# Altium project PCB_Project.PrjPcb
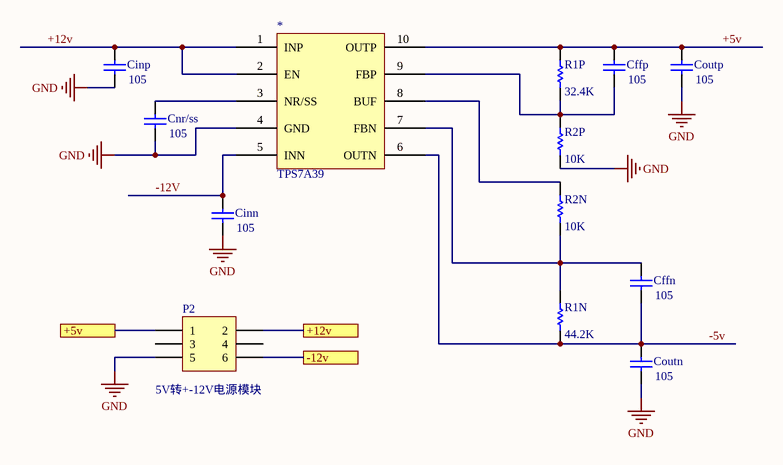
[diagram p0: 电源模块.schdoc]
3 sheets, 278 parts. Net scope: flat (ports and power ports of the same name join across sheets).
Board file: AT long bus (13.3 x 4.2 inches).PCBDOC
Sheets:
  电源模块.schdoc
  总电路图.SchDoc
  总电路图2.SchDoc

## Sheet 电源模块.schdoc: AT long bus (13.3 x 4.2 inches)
size A4; Organization: Organization; Address1: Address1; Address2: Address2; Address3: Address3; Address4: Address4; DocumentNumber: 1; Revision: 0; SheetNumber: 2; SheetTotal: 2

### Parts
*  TPS7A39
Cffn  value 105  [RAD-0.3]  (hidden comment: Cap)
Cffp  value 105  [RAD-0.3]  (hidden comment: Cap)
Cinn  value 105  [RAD-0.3]  (hidden comment: Cap)
Cinp  value 105  [RAD-0.3]  (hidden comment: Cap)
Cnr/ss  value 105  [RAD-0.3]  (hidden comment: Cap)
Coutn  value 105  [RAD-0.3]  (hidden comment: Cap)
Coutp  value 105  [RAD-0.3]  (hidden comment: Cap)
P2  5V转+-12V电源模块  [HDR2X3]
R1N  value 44.2K  [AXIAL-0.3]  (hidden comment: Res1)
R1P  value 32.4K  [AXIAL-0.3]  (hidden comment: Res1)
R2N  value 10K  [AXIAL-0.3]  (hidden comment: Res1)
R2P  value 10K  [AXIAL-0.3]  (hidden comment: Res1)

### Ports
+5v, +12v, -12v

### Nets
GND: *.4(GND) Cinn.1 Cinp.1 Cnr/ss.1 Coutn.1 Coutp.1 P2.5 R2P.1
+5v: *.10(OUTP) Cffp.2 Coutp.2 R1P.2
+12v: *.1(INP) *.2(EN) Cinp.2
-5v: *.6(OUTN) Cffn.1 Coutn.2 R1N.1
-12V: *.5(INN) Cinn.2
Net*_3: *.3(NR/SS) Cnr/ss.2
Net*_7: *.7(FBN) Cffn.2 R1N.2 R2N.1
Net*_8: *.8(BUF) R2N.2
Net*_9: *.9(FBP) Cffp.1 R1P.1 R2P.2
NetP2_1: P2.1 ; port +5v
NetP2_2: P2.2 ; port +12v
NetP2_6: P2.6 ; port -12v

Not connected (* = marked no-connect by the designer): P2 3 4

### Library data of the parts
Cffn Cffp Cinn Cinp Cnr/ss Coutn Coutp = Cap: Capacitor; Published: 8-Jun-2000; LatestRevisionDate: 17-Jul-2002; LatestRevisionNote: Re-released for DXP Platform.; PackageReference: RAD-0.3; Publisher: Altium Limited; PackageDescription: Radial Cap, Thru-Hole; 2 Leads; 0.3 in Pin Spacing
P2 = Header 3X2: Header, 3-Pin, Dual row; LatestRevisionDate: 17-Jul-2002; LatestRevisionNote: Re-released for DXP Platform.; Publisher: Altium Limited
R1N R1P R2N R2P = Res1: Resistor; Published: 8-Jun-2000; LatestRevisionDate: 17-Jul-2002; LatestRevisionNote: Re-released for DXP Platform.; PackageReference: AXIAL-0.3; Publisher: Altium Limited; PackageDescription: Axial Device, Thru-Hole; 2 Leads; 0.3 in Pin Spacing

## Sheet 总电路图.SchDoc
size A2; Organization: Altium Limited; Address1: L3, 12a Rodborough Rd; Address2: Frenchs Forest; Address3: NSW; Address4: Australia 2086
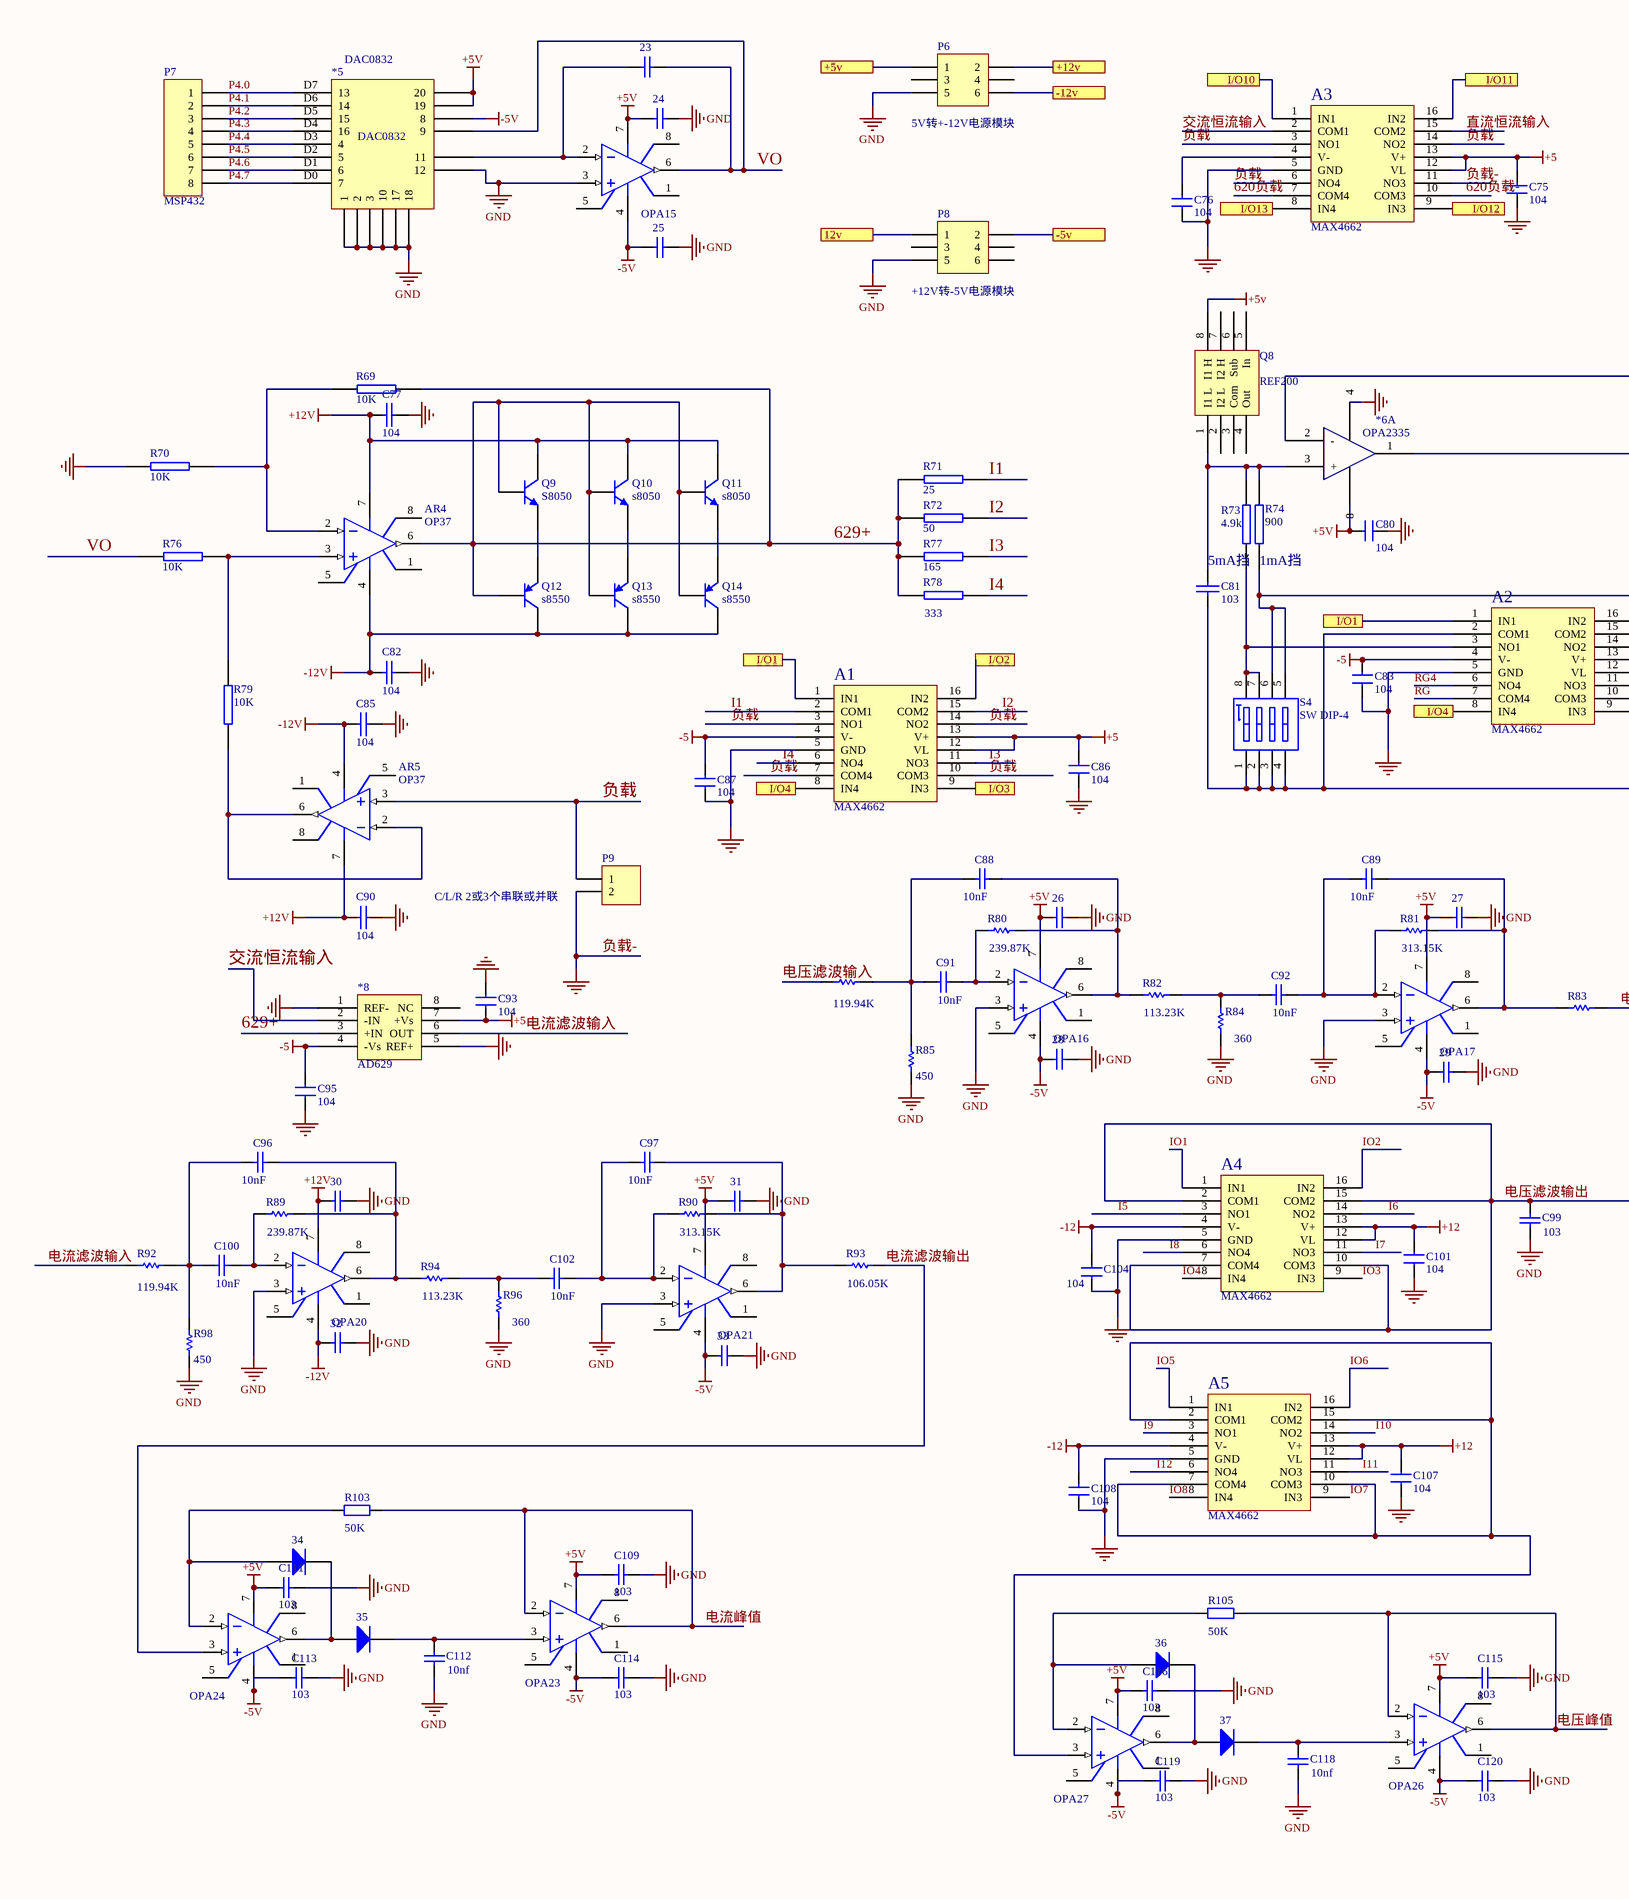
[diagram p1: 总电路图.SchDoc, left]
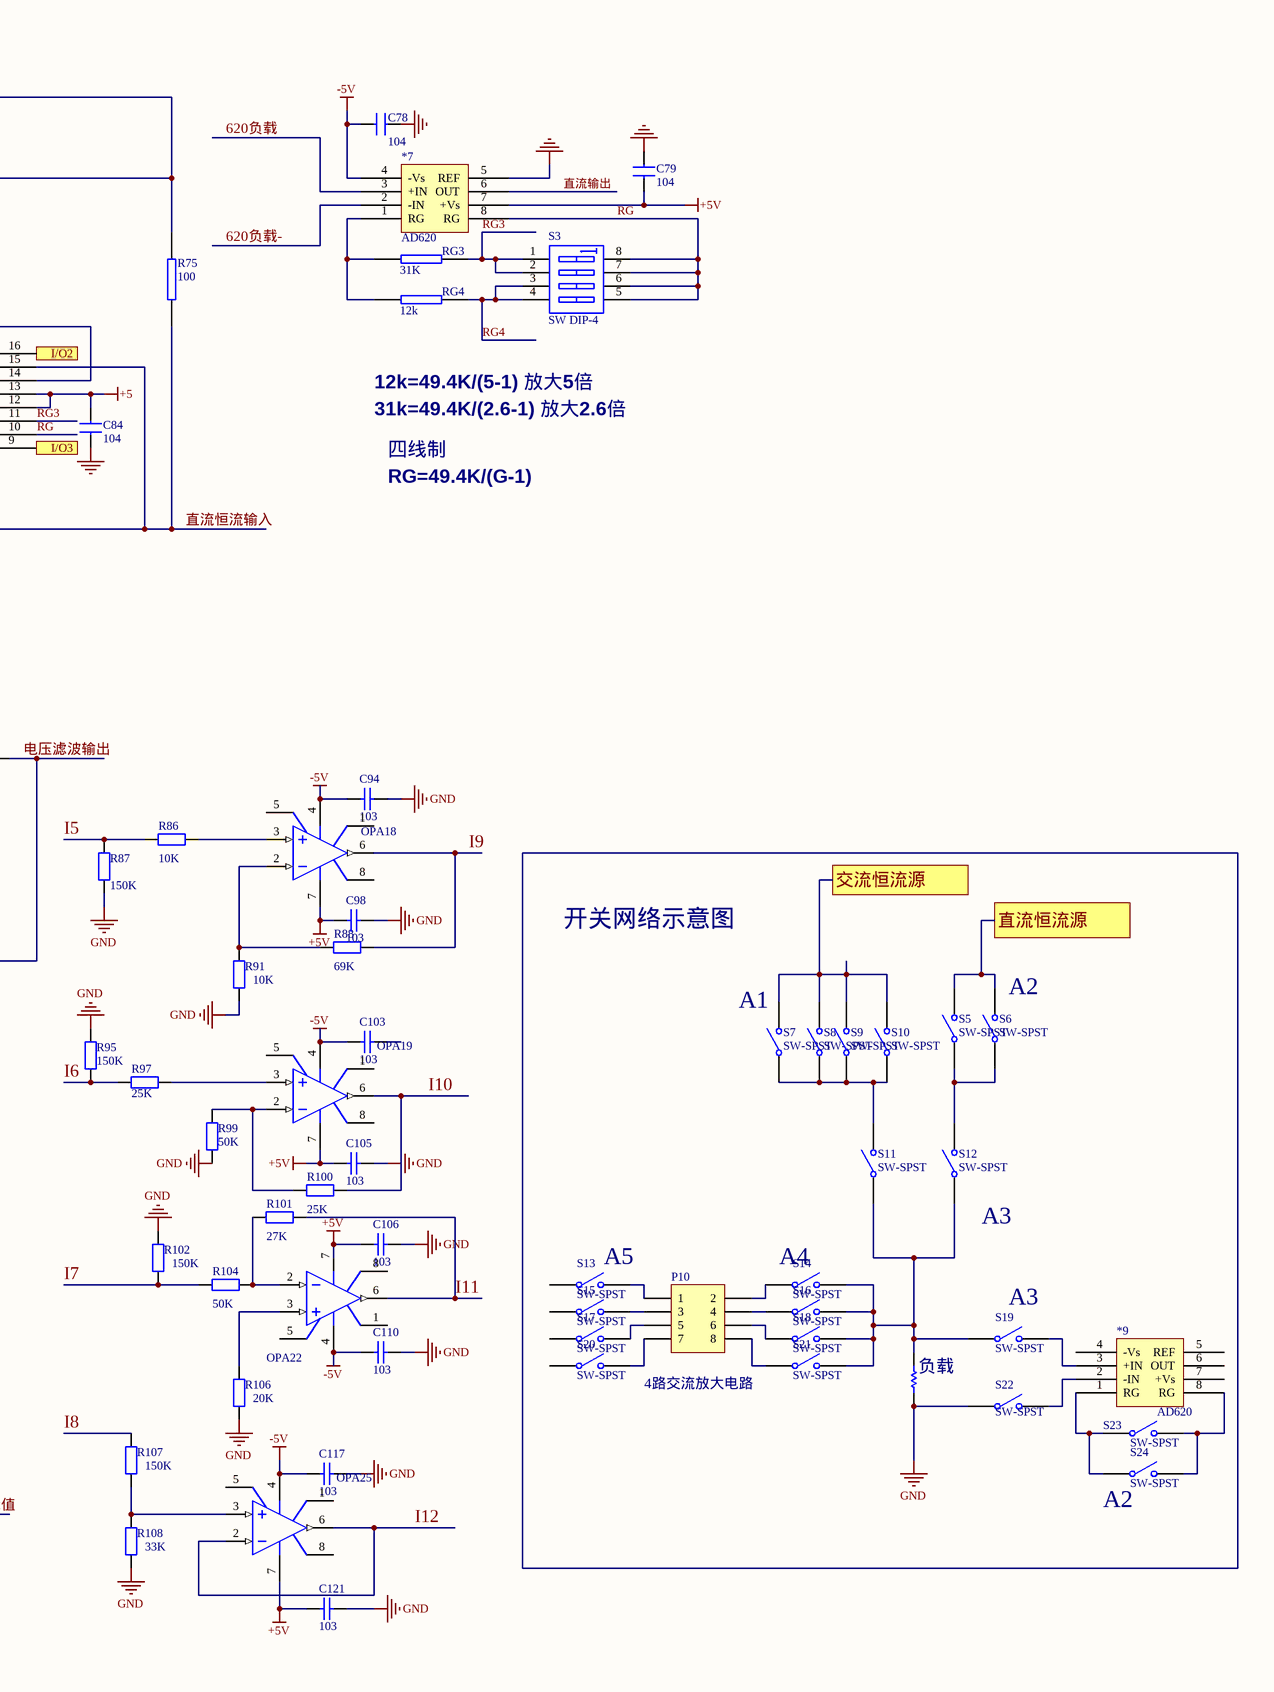
[diagram p2: 总电路图.SchDoc, right]

### Parts
23  Cap  [RAD-0.3]  (value not drawn)
24  Cap  [RAD-0.3]  (value not drawn)
25  Cap  [RAD-0.3]  (value not drawn)
26  Cap  [RAD-0.3]  (value not drawn)
27  Cap  [RAD-0.3]  (value not drawn)
28  Cap  [RAD-0.3]  (value not drawn)
29  Cap  [RAD-0.3]  (value not drawn)
30  Cap  [RAD-0.3]  (value not drawn)
31  Cap  [RAD-0.3]  (value not drawn)
32  Cap  [RAD-0.3]  (value not drawn)
33  Cap  [RAD-0.3]  (value not drawn)
34  Diode 1N4001  [DO-41]  (value not drawn)
35  Diode 1N4001  [DO-41]  (value not drawn)
36  Diode 1N4001  [DO-41]  (value not drawn)
37  Diode 1N4001  [DO-41]  (value not drawn)
*5  DAC0832
*6  OPA2335  (part A of 2)
*7  AD620
*8  AD629
*9  AD620
?  value 119.94K  [AXIAL-0.3]  (hidden comment: Res1)
A1  MAX4662
A2  MAX4662
A3  MAX4662
A4  MAX4662
A5  MAX4662
AR4  OP37  [H-08A]
AR5  OP37  [H-08A]
C75  104  [RAD0.1]
C76  104  [RAD0.1]
C77  104
C78  104  [RAD0.1]
C79  104  [RAD0.1]
C80  104  [RAD0.1]
C81  103
C82  104
C83  104  [RAD0.1]
C84  104  [RAD0.1]
C85  104
C86  104  [RAD0.1]
C87  104  [RAD0.1]
C88  value 10nF  [RAD-0.3]  (hidden comment: Cap)
C89  value 10nF  [RAD-0.3]  (hidden comment: Cap)
C90  104
C91  value 10nF  [RAD-0.3]  (hidden comment: Cap)
C92  value 10nF  [RAD-0.3]  (hidden comment: Cap)
C93  104  [RAD0.1]
C94  value 103  [RAD-0.3]  (hidden comment: Cap)
C95  104  [RAD0.1]
C96  value 10nF  [RAD-0.3]  (hidden comment: Cap)
C97  value 10nF  [RAD-0.3]  (hidden comment: Cap)
C98  value 103  [RAD-0.3]  (hidden comment: Cap)
C99  value 103  [RAD-0.3]  (hidden comment: Cap)
C100  value 10nF  [RAD-0.3]  (hidden comment: Cap)
C101  104  [RAD0.1]
C102  value 10nF  [RAD-0.3]  (hidden comment: Cap)
C103  value 103  [RAD-0.3]  (hidden comment: Cap)
C104  104  [RAD0.1]
C105  value 103  [RAD-0.3]  (hidden comment: Cap)
C106  value 103  [RAD-0.3]  (hidden comment: Cap)
C107  104  [RAD0.1]
C108  104  [RAD0.1]
C109  value 103  [RAD-0.3]  (hidden comment: Cap)
C110  value 103  [RAD-0.3]  (hidden comment: Cap)
C111  value 103  [RAD-0.3]  (hidden comment: Cap)
C112  value 10nf  [RAD-0.3]  (hidden comment: Cap)
C113  value 103  [RAD-0.3]  (hidden comment: Cap)
C114  value 103  [RAD-0.3]  (hidden comment: Cap)
C115  value 103  [RAD-0.3]  (hidden comment: Cap)
C116  value 103  [RAD-0.3]  (hidden comment: Cap)
C117  value 103  [RAD-0.3]  (hidden comment: Cap)
C118  value 10nf  [RAD-0.3]  (hidden comment: Cap)
C119  value 103  [RAD-0.3]  (hidden comment: Cap)
C120  value 103  [RAD-0.3]  (hidden comment: Cap)
C121  value 103  [RAD-0.3]  (hidden comment: Cap)
OPA15  Op Amp  [H-08A]  (value not drawn)
OPA16  Op Amp  [H-08A]  (value not drawn)
OPA17  Op Amp  [H-08A]  (value not drawn)
OPA18  Op Amp  [H-08A]  (value not drawn)
OPA19  Op Amp  [H-08A]  (value not drawn)
OPA20  Op Amp  [H-08A]  (value not drawn)
OPA21  Op Amp  [H-08A]  (value not drawn)
OPA22  Op Amp  [H-08A]  (value not drawn)
OPA23  Op Amp  [H-08A]  (value not drawn)
OPA24  Op Amp  [H-08A]  (value not drawn)
OPA25  Op Amp  [H-08A]  (value not drawn)
OPA26  Op Amp  [H-08A]  (value not drawn)
OPA27  Op Amp  [H-08A]  (value not drawn)
P6  5V转+-12V电源模块  [HDR2X3]
P7  MSP432  [HDR1X8]
P8  +12V转-5V电源模块  [HDR2X3]
P9  C/L/R 2或3个串联或并联  [HDR1X2H]
P10  4路交流放大电路  [HDR2X4]
Q8  REF200
Q9  S8050  [TO-92A]
Q10  s8050  [TO-92A]
Q11  s8050  [TO-92A]
Q12  s8550  [TO-92A]
Q13  s8550  [TO-92A]
Q14  s8550  [TO-92A]
R69  10K
R70  10K
R71  25
R72  50
R73  4.9k
R74  900
R75  100
R76  10K
R77  165
R78  333  [AXIAL0.3]
R79  10K
R80  value 239.87K  [AXIAL-0.3]  (hidden comment: Res1)
R81  value 313.15K  [AXIAL-0.3]  (hidden comment: Res1)
R82  value 113.23K  [AXIAL-0.3]  (hidden comment: Res1)
R83  Res1  [AXIAL-0.3]  (value not drawn)
R84  value 360  [AXIAL-0.3]  (hidden comment: Res1)
R85  value 450  [AXIAL-0.3]  (hidden comment: Res1)
R86  value 10K  [AXIAL-0.4]  (hidden comment: Res2)
R87  value 150K  [AXIAL-0.4]  (hidden comment: Res2)
R88  value 69K  [AXIAL-0.4]  (hidden comment: Res2)
R89  value 239.87K  [AXIAL-0.3]  (hidden comment: Res1)
R90  value 313.15K  [AXIAL-0.3]  (hidden comment: Res1)
R91  value 10K  [AXIAL-0.4]  (hidden comment: Res2)
R92  value 119.94K  [AXIAL-0.3]  (hidden comment: Res1)
R93  value 106.05K  [AXIAL-0.3]  (hidden comment: Res1)
R94  value 113.23K  [AXIAL-0.3]  (hidden comment: Res1)
R95  value 150K  [AXIAL-0.4]  (hidden comment: Res2)
R96  value 360  [AXIAL-0.3]  (hidden comment: Res1)
R97  value 25K  [AXIAL-0.4]  (hidden comment: Res2)
R98  value 450  [AXIAL-0.3]  (hidden comment: Res1)
R99  value 50K  [AXIAL-0.4]  (hidden comment: Res2)
R100  value 25K  [AXIAL-0.4]  (hidden comment: Res2)
R101  value 27K  [AXIAL-0.4]  (hidden comment: Res2)
R102  value 150K  [AXIAL-0.4]  (hidden comment: Res2)
R103  value 50K  [AXIAL-0.4]  (hidden comment: Res2)
R104  value 50K  [AXIAL-0.4]  (hidden comment: Res2)
R105  value 50K  [AXIAL-0.4]  (hidden comment: Res2)
R106  value 20K  [AXIAL-0.4]  (hidden comment: Res2)
R107  value 150K  [AXIAL-0.4]  (hidden comment: Res2)
R108  value 33K  [AXIAL-0.4]  (hidden comment: Res2)
RG3  31K  [AXIAL0.3]
RG4  12k  [AXIAL0.3]
S3  SW DIP-4  [SO8_N]
S4  SW DIP-4  [SO8_N]
S5  SW-SPST  [SPST-2]
S6  SW-SPST  [SPST-2]
S7  SW-SPST  [SPST-2]
S8  SW-SPST  [SPST-2]
S9  SW-SPST  [SPST-2]
S10  SW-SPST  [SPST-2]
S11  SW-SPST  [SPST-2]
S12  SW-SPST  [SPST-2]
S13  SW-SPST  [SPST-2]
S14  SW-SPST  [SPST-2]
S15  SW-SPST  [SPST-2]
S16  SW-SPST  [SPST-2]
S17  SW-SPST  [SPST-2]
S18  SW-SPST  [SPST-2]
S19  SW-SPST  [SPST-2]
S20  SW-SPST  [SPST-2]
S21  SW-SPST  [SPST-2]
S22  SW-SPST  [SPST-2]
S23  SW-SPST  [SPST-2]
S24  SW-SPST  [SPST-2]
负载  Res1  [AXIAL-0.3]  (value not drawn)

### Ports
12v, +5v, +12v, -5v, -12v, I/O1, I/O2, I/O3, I/O4, I/O10, I/O11, I/O12, I/O13, 交流恒流源, 直流恒流源

### Nets
+5: *8.7(+Vs) A1.12(VL) A1.13(V+) A2.12(VL) A2.13(V+) A3.12(VL) A3.13(V+) C75.1 C84.1 C86.1 C93.1
+5V: 24.1 26.1 27.1 31.1 *5.D14(20) *5.D15(19) *7.7(+Vs) C79.1 C80.1 C98.2 C105.2 C106.2 C109.2 C111.2 C115.2 C116.2 C121.2 OPA15.7(V+) OPA16.7(V+) OPA17.7(V+) OPA18.7(V+) OPA19.7(V+) OPA21.7(V+) OPA22.7(V+) OPA23.7(V+) OPA24.7(V+) OPA25.7(V+) OPA26.7(V+) OPA27.7(V+) Q8.8(I1_H)
+12: A4.12(VL) A4.13(V+) A5.12(VL) A5.13(V+) C101.1 C107.1
+12V: 30.1 AR4.7(V+) AR5.7(V+) C77.1 C90.1 OPA20.7(V+) Q9.3(C) Q10.3(C) Q11.3(C)
-5: *8.4(-Vs) A1.4(V-) A2.4(V-) C83.2 C87.2 C95.1
-5V: 25.1 28.1 29.1 33.1 *5.D16(8) *7.4(-Vs) C78.1 C94.2 C103.2 C110.2 C113.2 C114.2 C117.2 C119.2 C120.2 OPA15.4(V-) OPA16.4(V-) OPA17.4(V-) OPA18.4(V-) OPA19.4(V-) OPA21.4(V-) OPA22.4(V-) OPA23.4(V-) OPA24.4(V-) OPA25.4(V-) OPA26.4(V-) OPA27.4(V-)
-12: A4.4(V-) A5.4(V-) C104.2 C108.2
-12V: 32.1 AR4.4(V-) AR5.4(V-) C82.1 C85.1 OPA20.4(V-) Q12.3(C) Q13.3(C) Q14.3(C)
GND: 24.2 25.2 26.2 27.2 28.2 29.2 30.2 31.2 32.2 33.2 *5.D8(1) *5.D9(2) *5.D10(3) *5.D11(10) *5.D12(17) *5.D13(18) *5.D19(12) A1.5(GND) A2.5(GND) A3.5(GND) A4.5(GND) A5.5(GND) C75.2 C76.1 C77.2 C78.2 C79.2 C80.2 C82.2 C83.1 C84.2 C85.2 C86.2 C87.1 C90.2 C93.2 C94.1 C95.2 C98.1 C99.1 C101.2 C104.1 C105.1 C106.1 C107.2 C108.1 C109.1 C110.1 C111.1 C112.2 C113.1 C114.1 C115.1 C116.1 C117.1 C118.2 C119.1 C120.1 C121.1 OPA15.3(IN+) OPA16.3(IN+) OPA17.3(IN+) OPA20.3(IN+) OPA21.3(IN+) P6.5 P8.5 R70.2 R84.1 R85.1 R87.2 R91.1 R95.2 R96.1 R98.1 R99.1 R102.2 R106.2 R108.2 S22.1(COMMON) 负载.1
负载-: *7.5(REF) *8.1(REF-) *8.5(REF+) A3.11(NO3) P9.2
620负载: *7.3(+IN) A3.7(COM4)
620负载-: *7.2(-IN) A3.10(COM3)
629+: *8.3(+IN) AR4.6(OUT) Q9.2(B) Q10.2(B) Q11.2(B) Q12.2(B) Q13.2(B) Q14.2(B) R69.2 R71.1 R72.1 R77.1 R78.2
I1: A1.2(COM1) R71.2
I2: A1.15(COM2) R72.2
I3: A1.11(NO3) R77.2
I4: A1.6(NO4) R78.1
I5: A4.3(NO1) R86.1 R87.1
I6: A4.14(NO2) R95.1 R97.1
I7: A4.11(NO3) R102.1 R104.2
I8: A4.6(NO4) R107.1
I9: A5.3(NO1) OPA18.6(OUT) R88.1
I10: A5.14(NO2) OPA19.6(OUT) R100.1
I11: A5.11(NO3) OPA22.6(OUT) R101.1
I12: A5.6(NO4) OPA25.2(IN-) OPA25.6(OUT)
IO1: A4.1(IN1)
IO2: A4.16(IN2)
IO3: A4.9(IN3)
IO4: A4.8(IN4)
IO5: A5.1(IN1)
IO6: A5.16(IN2)
IO7: A5.9(IN3)
IO8: A5.8(IN4)
P4.0: *5.D7(13) P7.1
P4.1: *5.D6(14) P7.2
P4.2: *5.D5(15) P7.3
P4.3: *5.D4(16) P7.4
P4.4: *5.D3(4) P7.5
P4.5: *5.D2(5) P7.6
P4.6: *5.D1(6) P7.7
P4.7: *5.D0(7) P7.8
RG: *7.8(RG) A2.7(COM4) A2.10(COM3) S3.5(B4) S3.6(B3) S3.7(B2) S3.8(B1)
RG3: A2.11(NO3) RG3.2 S3.1(A1) S3.2(A2)
RG4: A2.6(NO4) RG4.2 S3.3(A3) S3.4(A4)
VO: 23.2 *5.D17(9) OPA15.6(OUT) R76.1
交流恒流输入: *8.2(-IN) A3.2(COM1)
电压峰值: OPA26.2(IN-) OPA26.6(OUT) R105.2
电压滤波输入: ?.1
电压滤波输出: A4.2(COM1) A4.7(COM4) A4.10(COM3) A4.15(COM2) C99.2 R83.2
电流峰值: OPA23.2(IN-) OPA23.6(OUT) R103.2
电流滤波输入: *8.6(OUT) R92.1
电流滤波输出: OPA24.3(IN+) R93.2
直流恒流输入: A2.2(COM1) A2.15(COM2) A3.15(COM2) C81.1 R75.1 S4.1(A1) S4.2(A2) S4.3(A3) S4.4(A4)
直流输出: *7.6(OUT)
负载: A1.3(NO1) A1.7(COM4) A1.10(COM3) A1.14(NO2) A3.3(NO1) A3.6(NO4) A3.14(NO2) AR5.3(IN+) P9.1
Net23_1: 23.1 *5.D18(11) OPA15.2(IN-)
Net34_1: 34.1(A) OPA24.2(IN-) R103.1
Net34_2: 34.2(K) 35.1(A) OPA24.6(OUT)
Net35_2: 35.2(K) C112.1 OPA23.3(IN+)
Net36_1: 36.1(A) OPA27.2(IN-) R105.1
Net36_2: 36.2(K) 37.1(A) OPA27.6(OUT)
Net37_2: 37.2(K) C118.1 OPA26.3(IN+)
Net*6_1: *6.1 *6.2(-) R75.2
Net*6_3: *6.3(+) C81.2 Q8.1(I1_L) R73.2 R74.2
Net*7_1: *7.1(RG) RG3.1 RG4.1
Net*9_1: *9.1(RG) S23.1(COMMON) S24.1(COMMON)
Net*9_2: *9.2(-IN) S22.2(NO)
Net*9_3: *9.3(+IN) S19.2(NO)
Net*9_8: *9.8(RG) S23.2(NO) S24.2(NO)
Net?_2: ?.2 C88.1 C91.1 R85.2
NetA1_1: A1.1(IN1) A2.1(IN1) ; port I/O1
NetA1_8: A1.8(IN4) A2.8(IN4) ; port I/O4
NetA1_9: A1.9(IN3) A2.9(IN3) ; port I/O3
NetA1_16: A1.16(IN2) A2.16(IN2) ; port I/O2
NetA2_3: A2.3(NO1) R73.1 S4.7(B2) S4.8(B1)
NetA2_14: A2.14(NO2) R74.1 S4.5(B4) S4.6(B3)
NetA3_1: A3.1(IN1) ; port I/O10
NetA3_4: A3.4(V-) C76.2
NetA3_8: A3.8(IN4) ; port I/O13
NetA3_9: A3.9(IN3) ; port I/O12
NetA3_16: A3.16(IN2) ; port I/O11
NetA5_2: A5.2(COM1) A5.7(COM4) A5.10(COM3) A5.15(COM2) OPA27.3(IN+)
NetAR4_2: AR4.2(IN-) R69.1 R70.1
NetAR4_3: AR4.3(IN+) R76.2 R79.1
NetAR5_2: AR5.2(IN-) AR5.6(OUT) R79.2
NetC88_2: C88.2 OPA16.6(OUT) R80.2 R82.1
NetC89_1: C89.1 C92.2 OPA17.2(IN-) R81.1
NetC89_2: C89.2 OPA17.6(OUT) R81.2 R83.1
NetC91_2: C91.2 OPA16.2(IN-) R80.1
NetC92_1: C92.1 R82.2 R84.2
NetC96_1: C96.1 C100.1 R92.2 R98.2
NetC96_2: C96.2 OPA20.6(OUT) R89.2 R94.1
NetC97_1: C97.1 C102.2 OPA21.2(IN-) R90.1
NetC97_2: C97.2 OPA21.6(OUT) R90.2 R93.1
NetC100_2: C100.2 OPA20.2(IN-) R89.1
NetC102_1: C102.1 R94.2 R96.2
NetOPA18_2: OPA18.2(IN-) R88.2 R91.2
NetOPA18_3: OPA18.3(IN+) R86.2
NetOPA19_2: OPA19.2(IN-) R99.2 R100.2
NetOPA19_3: OPA19.3(IN+) R97.2
NetOPA22_2: OPA22.2(IN-) R101.2 R104.1
NetOPA22_3: OPA22.3(IN+) R106.1
NetOPA25_3: OPA25.3(IN+) R107.2 R108.1
NetP2_1: P6.1 ; port +5v
NetP2_2: P6.2 ; port +12v
NetP2_6: P6.6 ; port -12v
NetP8_1: P8.1 ; port 12v
NetP8_2: P8.2 ; port -5v
NetP10_1: P10.1 S13.2(NO)
NetP10_2: P10.2 S14.1(COMMON)
NetP10_3: P10.3 S15.2(NO)
NetP10_4: P10.4 S16.1(COMMON)
NetP10_5: P10.5 S17.2(NO)
NetP10_6: P10.6 S18.1(COMMON)
NetP10_7: P10.7 S20.2(NO)
NetP10_8: P10.8 S21.1(COMMON)
NetQ9_1: Q9.1(E) Q12.1(E)
NetQ10_1: Q10.1(E) Q13.1(E)
NetQ11_1: Q11.1(E) Q14.1(E)
NetS5_1: S5.1(COMMON) S6.1(COMMON) S12.2(NO)
NetS5_2: S5.2(NO) S6.2(NO) ; port 直流恒流源
NetS7_1: S7.1(COMMON) S8.1(COMMON) S9.1(COMMON) S10.1(COMMON) S11.2(NO)
NetS7_2: S7.2(NO) S8.2(NO) S9.2(NO) S10.2(NO) ; port 交流恒流源
NetS11_1: S11.1(COMMON) S12.1(COMMON) S14.2(NO) S16.2(NO) S18.2(NO) S19.1(COMMON) S21.2(NO) 负载.2

Not connected (* = marked no-connect by the designer): *6 ?1(4) ?2(8); *8 8(NC); *9 4(-Vs) 5(REF) 6(OUT) 7(+Vs); AR4 1(OS_NUL) 5(OS_NUL) 8(TAB); AR5 1(OS_NUL) 5(OS_NUL) 8(TAB); C103 1; OPA15 1(OS_NUL) 5(OS_NUL) 8(TAB); OPA16 1(OS_NUL) 5(OS_NUL) 8(TAB); OPA17 1(OS_NUL) 5(OS_NUL) 8(TAB); OPA18 1(OS_NUL) 5(OS_NUL) 8(TAB); OPA19 1(OS_NUL) 5(OS_NUL) 8(TAB); OPA20 1(OS_NUL) 5(OS_NUL) 8(TAB); OPA21 1(OS_NUL) 5(OS_NUL) 8(TAB); OPA22 1(OS_NUL) 5(OS_NUL) 8(TAB); OPA23 1(OS_NUL) 5(OS_NUL) 8(TAB); OPA24 1(OS_NUL) 5(OS_NUL) 8(TAB); OPA25 1(OS_NUL) 5(OS_NUL) 8(TAB); OPA26 1(OS_NUL) 5(OS_NUL) 8(TAB); OPA27 1(OS_NUL) 5(OS_NUL) 8(TAB); P6 3 4; P8 3 4 6; Q8 2(I2_L) 3(Com) 4(Out) 5(In) 6(Sub) 7(I2_H); S13 1(COMMON); S15 1(COMMON); S17 1(COMMON); S20 1(COMMON)

### Notes on the sheet
- 5mA挡
- 1mA挡
- 12k=49.4K/(5-1) 放大5倍
- 31k=49.4K/(2.6-1) 放大2.6倍
- 四线制
- RG=49.4K/(G-1)
- 开关网络示意图
- (near S7) A1
- (near S6) A2
- (near S13) A5
- (near S14) A4
- (near S12) A3
- (near S19) A3
- (near S24) A2
- Title
- Size:
- Date:
- File:
- Number:
- Time:
- Revision:
- Sheet
- of

### Library data of the parts
23-33 = Cap: Capacitor; Value: 100pF; Published: 8-Jun-2000; LatestRevisionDate: 17-Jul-2002; LatestRevisionNote: Re-released for DXP Platform.; PackageReference: RAD-0.3; Publisher: Altium Limited; PackageDescription: Radial Cap, Thru-Hole; 2 Leads; 0.3 in Pin Spacing
34-37 = Diode 1N4001: 1 Amp General Purpose Rectifier; Published: 8-Jun-2000; LatestRevisionDate: 17-Jul-2002; LatestRevisionNote: Re-released for DXP Platform.; DatasheetVersion: 1998; PackageVersion: Aug-1999; PackageReference: DO-41; Publisher: Altium Limited; PackageDescription: Diode, Axial; Body 5.2 x 2.7 mm (LxDia. max), Lead Dia. 0.86 mm (max); Code_JEDEC: DO-204-AL; ComponentLink1Description: Manufacturer Link; ComponentLink1URL: http://www.fairchildsemi.com/; ComponentLink2Description: Datasheet; ComponentLink2URL: http://www.fairchildsemi.com/ds/1N%2F1N4001.pdf
*5 Q8 = Component_1
? R80-R85 R89 R90 R92-R94 R96 R98 负载 = Res1: Resistor; Published: 8-Jun-2000; LatestRevisionDate: 17-Jul-2002; LatestRevisionNote: Re-released for DXP Platform.; PackageReference: AXIAL-0.3; Publisher: Altium Limited; PackageDescription: Axial Device, Thru-Hole; 2 Leads; 0.3 in Pin Spacing
A1-A5 = MAX2662
AR4 AR5 OPA15-OPA27 = Op Amp: FET Operational Amplifier; Published: 8-Jun-2000; LatestRevisionDate: 17-Jul-2002; LatestRevisionNote: Re-released for DXP Platform.; DatasheetVersion: REV. B; PackageVersion: 1990; PackageReference: H-08A; Publisher: Altium Limited; PackageDescription: Can; 8 Leads; Pin Circle Dia. 5.08 mm; Lead Dia. 0.53 mm (max); ComponentLink1Description: Manufacturer Link; ComponentLink1URL: http://www.analog.com/
C75-C87 C90 C93 C95 C101 C104 C107 C108 = CAP: Capacitor
  C75 C76 C78-C80 C83 C84 C86 C87 C93 C95 C101 C104 C107 C108: Value: 104
C88 C89 C91 C92 C94 C96-C100 C102 C103 C105 C106 C109-C121 = Cap: Capacitor; Published: 8-Jun-2000; LatestRevisionDate: 17-Jul-2002; LatestRevisionNote: Re-released for DXP Platform.; PackageReference: RAD-0.3; Publisher: Altium Limited; PackageDescription: Radial Cap, Thru-Hole; 2 Leads; 0.3 in Pin Spacing
P6 P8 = Header 3X2: Header, 3-Pin, Dual row; LatestRevisionDate: 17-Jul-2002; LatestRevisionNote: Re-released for DXP Platform.; Publisher: Altium Limited
P7 = Header 8: Header, 8-Pin; LatestRevisionDate: 17-Jul-2002; LatestRevisionNote: Re-released for DXP Platform.; Publisher: Altium Limited
P9 = Header 2H: Header, 2-Pin, Right Angle; LatestRevisionDate: 17-Jul-2002; LatestRevisionNote: Re-released for DXP Platform.; Publisher: Altium Limited
P10 = Header 4X2: Header, 4-Pin, Dual row; LatestRevisionDate: 17-Jul-2002; LatestRevisionNote: Re-released for DXP Platform.; Publisher: Altium Limited
Q9-Q11 = 2N3904: NPN General Purpose Amplifier; Published: 8-Jun-2000; LatestRevisionDate: 15-Jan-2003; LatestRevisionNote: PCB Footprint 'BCY-W3/D4.7' replaced; DatasheetVersion: 1997; PackageVersion: Sep-1998; PackageReference: TO-92A; Publisher: Altium Limited; PackageDescription: TO, Flat Index; 3 In-Line, Axial Leads; Body Dia. 4.5mm; Leads 0.51 x 0.48 mm (max); ComponentLink1Description: Manufacturer Link; ComponentLink1URL: http://www.fairchildsemi.com/; ComponentLink2Description: Datasheet; ComponentLink2URL: http://www.fairchildsemi.com/ds/2N%2F2N3904.pdf
Q12-Q14 = 2N3906: PNP General Purpose Amplifier; Published: 8-Jun-2000; LatestRevisionDate: 15-Jan-2003; LatestRevisionNote: PCB Footprint 'BCY-W3/D4.7' replaced; DatasheetVersion: 1997; PackageVersion: Sep-1998; PackageReference: TO-92A; Publisher: Altium Limited; PackageDescription: TO, Flat Index; 3 In-Line, Axial Leads; Body Dia. 4.5mm; Leads 0.51 x 0.48 mm (max); ComponentLink1Description: Manufacturer Link; ComponentLink1URL: http://www.fairchildsemi.com/; ComponentLink2Description: Datasheet; ComponentLink2URL: http://www.fairchildsemi.com/ds/2N%2F2N3906.pdf
R69-R79 RG3 RG4 = RES2
R86-R88 R91 R95 R97 R99-R108 = Res2: Resistor; Published: 8-Jun-2000; LatestRevisionDate: 17-Jul-2002; LatestRevisionNote: Re-released for DXP Platform.; PackageReference: AXIAL-0.4; Publisher: Altium Limited; PackageDescription: Axial Device, Thru-Hole; 2 Leads; 0.4 in Pin Spacing
S3 S4 = SW DIP-4: DIP Switch, 4 Position, SPST; Published: 24-Mar-1999; LatestRevisionDate: 29-May-2009; LatestRevisionNote: IPC-7351 Footprint Added.; PackageVersion: Dec-2002; PackageReference: SO8; Publisher: Altium Limited; PackageDescription: 8-Pin Small Outline Integrated Circuit 1.27 mm Pitch; Code_JEDEC: MS-012-AA; Code_IPC: SOIC127P600-8
S5-S24 = SW-SPST: Single-Pole, Single-Throw Switch; Published: 24-Mar-1999; LatestRevisionDate: 17-Jul-2002; LatestRevisionNote: Re-released for DXP Platform.; PackageReference: SPST-2; Publisher: Altium Limited; PackageDescription: Switch; 2 Leads

## Sheet 总电路图2.SchDoc
size A3; Organization: Altium Limited; Address1: L3, 12a Rodborough Rd; Address2: Frenchs Forest; Address3: NSW; Address4: Australia 2086
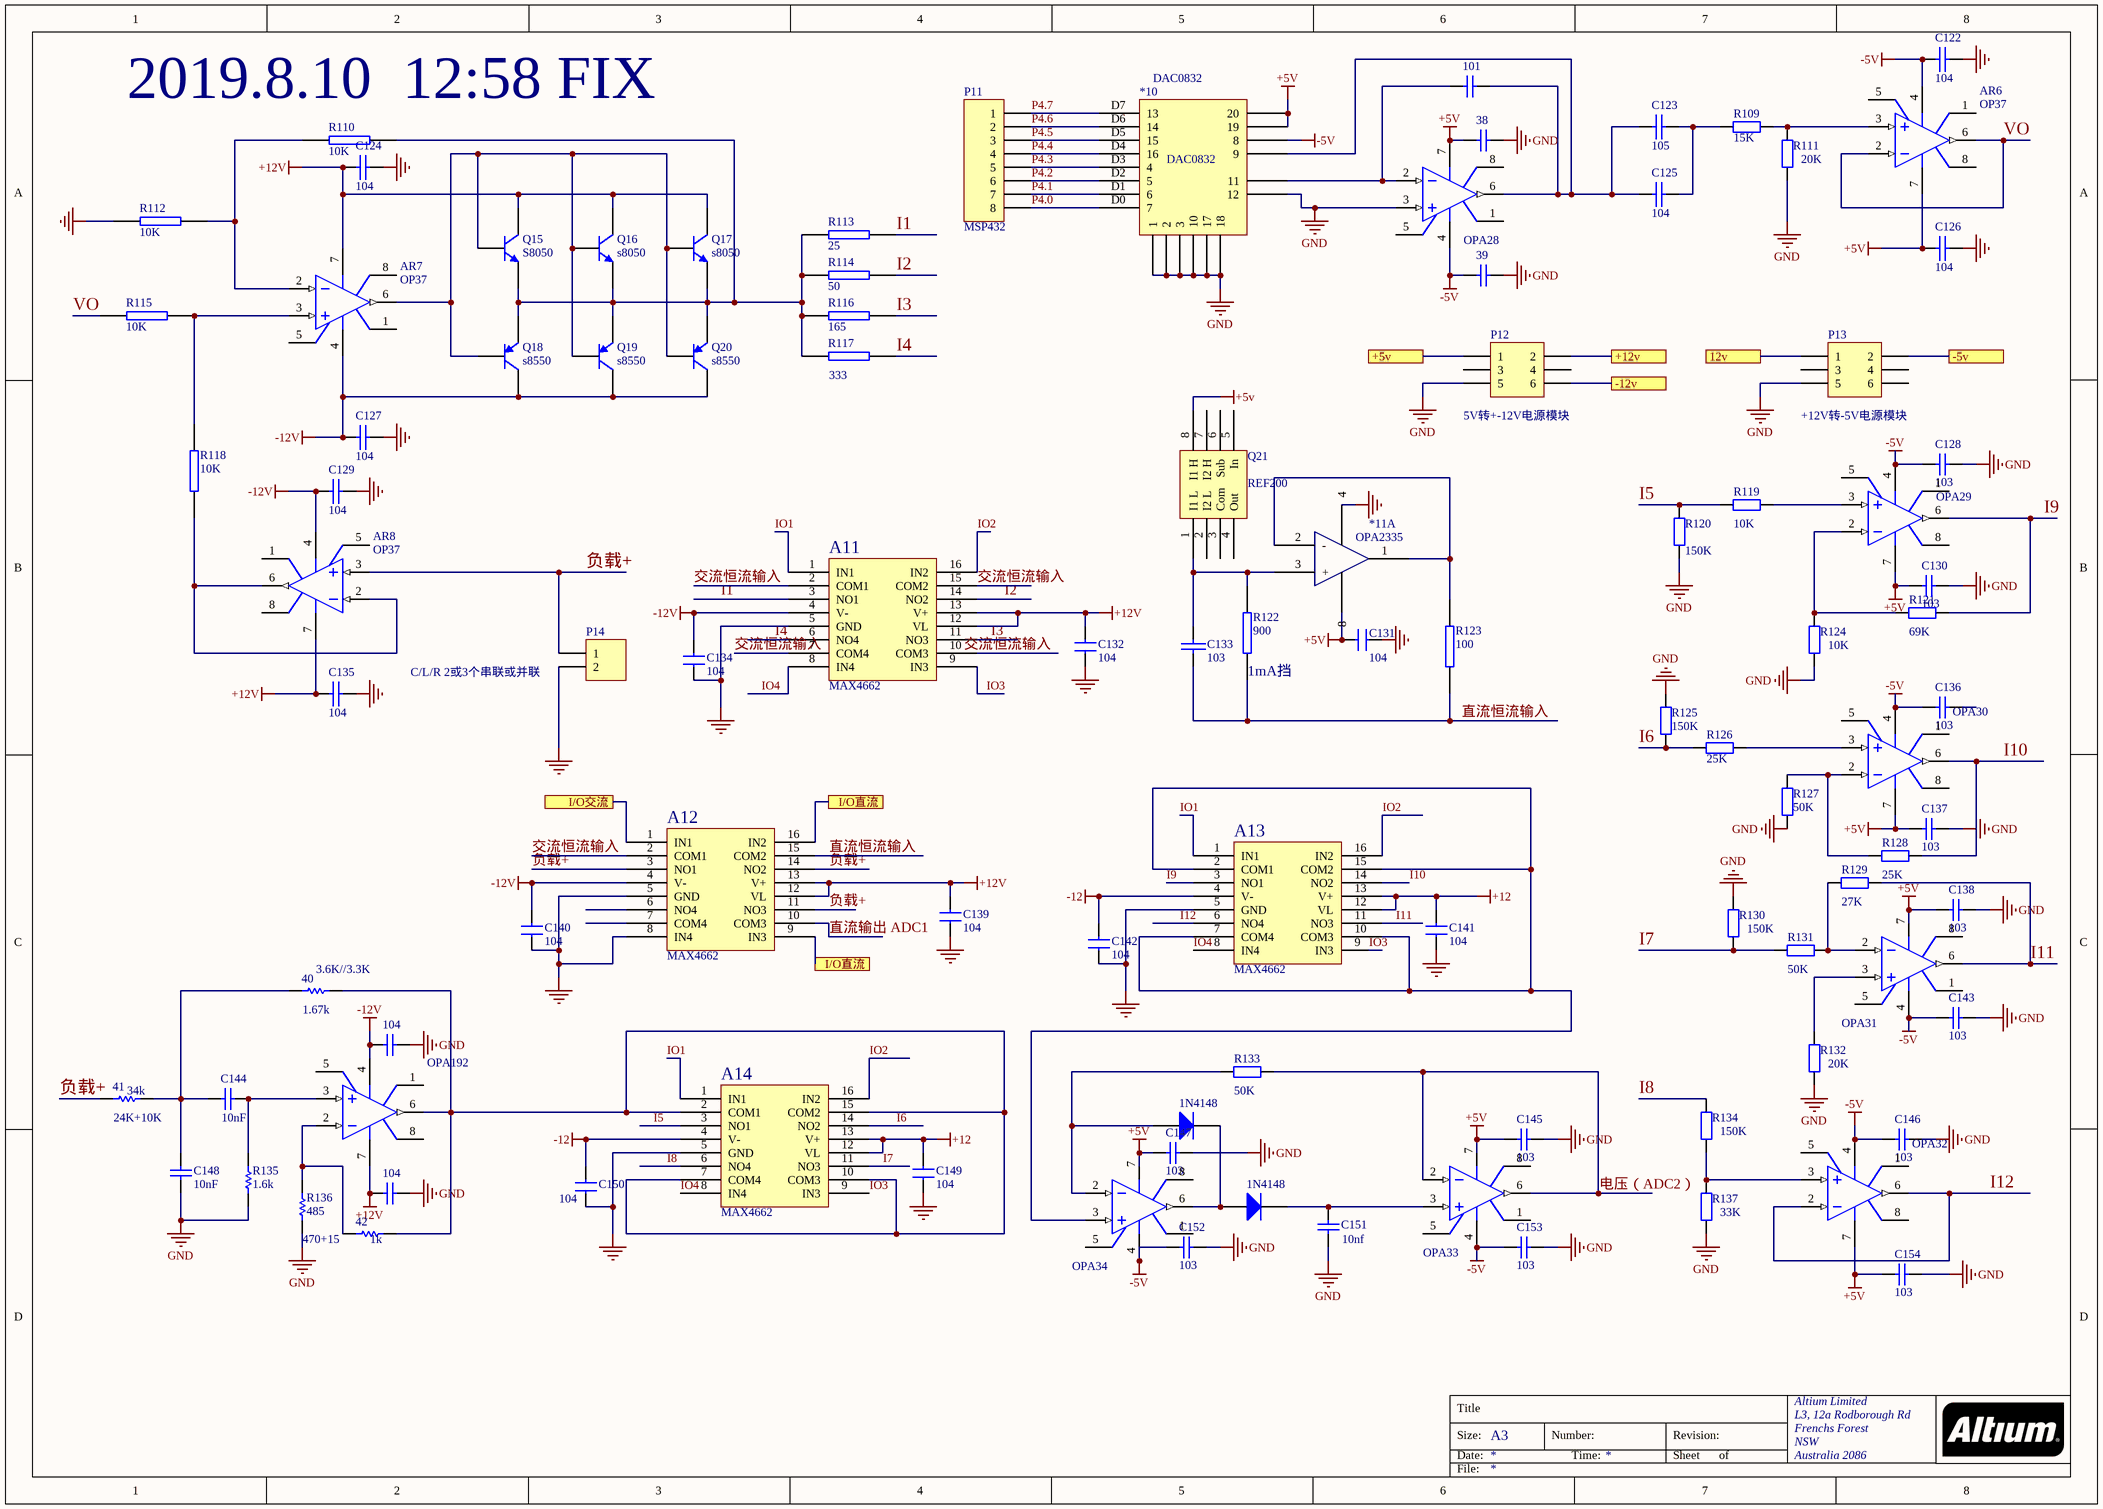
[diagram p3: 总电路图2.SchDoc]

### Parts
(Parts that share a designator on the sheet are numbered #1, #2 ... from top to bottom, then left to right.)
1N4148#1  Diode 1N4001  [DO-41]  (value not drawn)
1N4148#2  Diode 1N4001  [DO-41]  (value not drawn)
38  Cap  [RAD-0.3]  (value not drawn)
39  Cap  [RAD-0.3]  (value not drawn)
40  value 1.67k  [AXIAL-0.3]  (hidden comment: Res1)
41  value 34k  [AXIAL-0.3]  (hidden comment: Res1)
42  value 1k  [AXIAL-0.3]  (hidden comment: Res1)
101  Cap  [RAD-0.3]  (value not drawn)
104#1  Cap  [RAD-0.3]  (value not drawn)
104#2  Cap  [RAD-0.3]  (value not drawn)
*10  DAC0832
*11  OPA2335  (part A of 2)
A11  MAX4662  [DIP16-300_MH]
A12  MAX4662  [DIP16-300_MH]
A13  MAX4662  [DIP16-300_MH]
A14  MAX4662  [DIP16-300_MH]
AR6  OP37  [H-08A]
AR7  OP37  [H-08A]
AR8  OP37  [H-08A]
C122  104
C123  105
C124  104
C125  104
C126  104
C127  104
C128  value 103  [RAD-0.3]  (hidden comment: Cap)
C129  104
C130  value 103  [RAD-0.3]  (hidden comment: Cap)
C131  104  [RAD0.1]
C132  104  [RAD0.1]
C133  103
C134  104  [RAD0.1]
C135  104
C136  value 103  [RAD-0.3]  (hidden comment: Cap)
C137  value 103  [RAD-0.3]  (hidden comment: Cap)
C138  value 103  [RAD-0.3]  (hidden comment: Cap)
C139  104  [RAD0.1]
C140  104  [RAD0.1]
C141  104  [RAD0.1]
C142  104  [RAD0.1]
C143  value 103  [RAD-0.3]  (hidden comment: Cap)
C144  value 10nF  [RAD-0.3]  (hidden comment: Cap)
C145  value 103  [RAD-0.3]  (hidden comment: Cap)
C146  value 103  [RAD-0.3]  (hidden comment: Cap)
C147  value 103  [RAD-0.3]  (hidden comment: Cap)
C148  value 10nF  [RAD-0.3]  (hidden comment: Cap)
C149  104  [RAD0.1]
C150  104  [RAD0.1]
C151  value 10nf  [RAD-0.3]  (hidden comment: Cap)
C152  value 103  [RAD-0.3]  (hidden comment: Cap)
C153  value 103  [RAD-0.3]  (hidden comment: Cap)
C154  value 103  [RAD-0.3]  (hidden comment: Cap)
OPA28  Op Amp  [H-08A]  (value not drawn)
OPA29  Op Amp  [H-08A]  (value not drawn)
OPA30  Op Amp  [H-08A]  (value not drawn)
OPA31  Op Amp  [H-08A]  (value not drawn)
OPA32  Op Amp  [H-08A]  (value not drawn)
OPA33  Op Amp  [H-08A]  (value not drawn)
OPA34  Op Amp  [H-08A]  (value not drawn)
OPA192  Op Amp  [H-08A]  (value not drawn)
P11  MSP432  [HDR1X8]
P12  5V转+-12V电源模块  [HDR2X3]
P13  +12V转-5V电源模块  [HDR2X3]
P14  C/L/R 2或3个串联或并联  [HDR1X2H]
Q15  S8050  [TO-92A]
Q16  s8050  [TO-92A]
Q17  s8050  [TO-92A]
Q18  s8550  [TO-92A]
Q19  s8550  [TO-92A]
Q20  s8550  [TO-92A]
Q21  REF200
R109  value 15K  [AXIAL-0.4]  (hidden comment: Res2)
R110  10K  [RS 1/4W]
R111  value 20K  [AXIAL-0.4]  (hidden comment: Res2)
R112  10K  [RS 1/4W]
R113  25  [RS 1/4W]
R114  50  [RS 1/4W]
R115  10K  [RS 1/4W]
R116  165  [RS 1/4W]
R117  333  [RS 1/4W]
R118  10K  [RS 1/4W]
R119  value 10K  [AXIAL-0.4]  (hidden comment: Res2)
R120  value 150K  [AXIAL-0.4]  (hidden comment: Res2)
R121  value 69K  [AXIAL-0.4]  (hidden comment: Res2)
R122  900  [RS 1/4W]
R123  100  [RS 1/4W]
R124  value 10K  [AXIAL-0.4]  (hidden comment: Res2)
R125  value 150K  [AXIAL-0.4]  (hidden comment: Res2)
R126  value 25K  [AXIAL-0.4]  (hidden comment: Res2)
R127  value 50K  [AXIAL-0.4]  (hidden comment: Res2)
R128  value 25K  [AXIAL-0.4]  (hidden comment: Res2)
R129  value 27K  [AXIAL-0.4]  (hidden comment: Res2)
R130  value 150K  [AXIAL-0.4]  (hidden comment: Res2)
R131  value 50K  [AXIAL-0.4]  (hidden comment: Res2)
R132  value 20K  [AXIAL-0.4]  (hidden comment: Res2)
R133  value 50K  [AXIAL-0.4]  (hidden comment: Res2)
R134  value 150K  [AXIAL-0.4]  (hidden comment: Res2)
R135  value 1.6k  [AXIAL-0.3]  (hidden comment: Res1)
R136  value 485  [AXIAL-0.3]  (hidden comment: Res1)
R137  value 33K  [AXIAL-0.4]  (hidden comment: Res2)

### Ports
12v, +5v, +12v, -5v, -12v, I/O交流, I/O直流

### Nets
+5V: 38.1 *10.D14(20) *10.D15(19) AR6.7(V+) C126.1 C130.2 C131.1 C137.2 C138.2 C145.2 C147.2 C154.2 OPA28.7(V+) OPA29.7(V+) OPA30.7(V+) OPA31.7(V+) OPA32.7(V+) OPA33.7(V+) OPA34.7(V+) Q21.8(I1_H)
+12: A13.12(VL) A13.13(V+) A14.12(VL) A14.13(V+) C141.1 C149.1
+12V: 104#2.1 A11.12(VL) A11.13(V+) A12.12(VL) A12.13(V+) AR7.7(V+) AR8.7(V+) C124.1 C132.1 C135.1 C139.1 OPA192.7(V+) Q15.3(C) Q16.3(C) Q17.3(C)
-5V: 39.1 *10.D16(8) AR6.4(V-) C122.1 C128.2 C136.2 C143.2 C146.2 C152.2 C153.2 OPA28.4(V-) OPA29.4(V-) OPA30.4(V-) OPA31.4(V-) OPA32.4(V-) OPA33.4(V-) OPA34.4(V-)
-12: A13.4(V-) A14.4(V-) C142.2 C150.2
-12V: 104#1.1 A11.4(V-) A12.4(V-) AR7.4(V-) AR8.4(V-) C127.1 C129.1 C134.2 C140.2 OPA192.4(V-) Q18.3(C) Q19.3(C) Q20.3(C)
GND: 38.2 39.2 104#1.2 104#2.2 *10.D8(1) *10.D9(2) *10.D10(3) *10.D11(10) *10.D12(17) *10.D13(18) *10.D19(12) A11.5(GND) A12.5(GND) A12.8(IN4) A13.5(GND) A14.5(GND) C122.2 C124.2 C126.2 C127.2 C128.1 C129.2 C130.1 C131.2 C132.2 C134.1 C135.2 C137.1 C138.1 C139.2 C140.1 C141.2 C142.1 C143.1 C145.1 C146.1 C147.1 C148.1 C149.2 C150.1 C151.2 C152.1 C153.1 C154.1 OPA28.3(IN+) P12.5 P13.5 R111.1 R112.2 R120.2 R124.1 R125.2 R127.1 R130.2 R132.2 R135.1 R136.1 R137.2
负载-: P14.2
I1: A11.3(NO1) R113.2
I2: A11.14(NO2) R114.2
I3: A11.11(NO3) R116.2
I4: A11.6(NO4) R117.1
I5: A14.3(NO1) R119.1 R120.1
I6: A14.14(NO2) R125.1 R126.1
I7: A14.11(NO3) R130.1 R131.2
I8: A14.6(NO4) R134.1
I9: A13.3(NO1) OPA29.6(OUT) R121.1
I10: A13.14(NO2) OPA30.6(OUT) R128.1
I11: A13.11(NO3) OPA31.6(OUT) R129.1
I12: A13.6(NO4) OPA32.2(IN-) OPA32.6(OUT)
IO1: A11.1(IN1) A13.1(IN1) A14.1(IN1)
IO2: A11.16(IN2) A13.16(IN2) A14.16(IN2)
IO3: A11.9(IN3) A13.9(IN3) A14.9(IN3)
IO4: A11.8(IN4) A13.8(IN4) A14.8(IN4)
P4.0: *10.D0(7) P11.8
P4.1: *10.D1(6) P11.7
P4.2: *10.D2(5) P11.6
P4.3: *10.D3(4) P11.5
P4.4: *10.D4(16) P11.4
P4.5: *10.D5(15) P11.3
P4.6: *10.D6(14) P11.2
P4.7: *10.D7(13) P11.1
VO: AR6.2(IN-) AR6.6(OUT) R115.1
交流恒流输入: A11.2(COM1) A11.7(COM4) A11.15(COM2) A12.2(COM1)
电压（ADC2）: OPA33.2(IN-) OPA33.6(OUT) R133.2
直流恒流输入: A12.15(COM2) C133.1 R122.1 R123.1
直流输出 ADC1: A12.10(COM3)
负载+: 41.1 A12.3(NO1) A12.11(NO3) A12.14(NO2) AR8.3(IN+) P14.1
Net1N4148#1_1: 1N4148#1.1(A) OPA34.2(IN-) R133.1
Net1N4148#1_2: 1N4148#1.2(K) 1N4148#2.1(A) OPA34.6(OUT)
Net1N4148#2_2: 1N4148#2.2(K) C151.1 OPA33.3(IN+)
Net40_1: 40.1 41.2 C144.1 C148.2
Net40_2: 40.2 42.2 A14.2(COM1) A14.7(COM4) A14.10(COM3) A14.15(COM2) OPA192.6(OUT)
Net42_1: 42.1 OPA192.2(IN-) R136.2
Net101_1: 101.1 *10.D18(11) OPA28.2(IN-)
Net101_2: 101.2 *10.D17(9) C123.2 C125.2 OPA28.6(OUT)
Net*11_1: *11.1 *11.2(-) R123.2
Net*11_3: *11.3(+) C133.2 Q21.1(I1_L) R122.2
NetA12_1: A12.1(IN1) ; port I/O交流
NetA12_9: A12.9(IN3) A12.16(IN2) ; port I/O直流
NetA13_2: A13.2(COM1) A13.7(COM4) A13.10(COM3) A13.15(COM2) OPA34.3(IN+)
NetAR6_3: AR6.3(IN+) R109.1 R111.2
NetAR7_2: AR7.2(IN-) R110.1 R112.1
NetAR7_3: AR7.3(IN+) R115.2 R118.1
NetAR7_6: AR7.6(OUT) Q15.2(B) Q16.2(B) Q17.2(B) Q18.2(B) Q19.2(B) Q20.2(B)
NetAR8_2: AR8.2(IN-) AR8.6(OUT) R118.2
NetC123_1: C123.1 C125.1 R109.2
NetC144_2: C144.2 OPA192.3(IN+) R135.2
NetOPA29_2: OPA29.2(IN-) R121.2 R124.2
NetOPA29_3: OPA29.3(IN+) R119.2
NetOPA30_2: OPA30.2(IN-) R127.2 R128.2
NetOPA30_3: OPA30.3(IN+) R126.2
NetOPA31_2: OPA31.2(IN-) R129.2 R131.1
NetOPA31_3: OPA31.3(IN+) R132.1
NetOPA32_3: OPA32.3(IN+) R134.2 R137.1
NetP2_1: P12.1 ; port +5v
NetP2_2: P12.2 ; port +12v
NetP2_6: P12.6 ; port -12v
NetP8_1: P13.1 ; port 12v
NetP8_2: P13.2 ; port -5v
NetQ15_1: Q15.1(E) Q16.1(E) Q17.1(E) Q18.1(E) Q19.1(E) Q20.1(E) R110.2 R113.1 R114.1 R116.1 R117.2

Not connected (* = marked no-connect by the designer): *11 ?1(4) ?2(8); A11 10(COM3); A12 6(NO4) 7(COM4); AR6 1(OS_NUL) 5(OS_NUL) 8(TAB); AR7 1(OS_NUL) 5(OS_NUL) 8(TAB); AR8 1(OS_NUL) 5(OS_NUL) 8(TAB); C136 1; OPA28 1(OS_NUL) 5(OS_NUL) 8(TAB); OPA29 1(OS_NUL) 5(OS_NUL) 8(TAB); OPA30 1(OS_NUL) 5(OS_NUL) 8(TAB); OPA31 1(OS_NUL) 5(OS_NUL) 8(TAB); OPA32 1(OS_NUL) 5(OS_NUL) 8(TAB); OPA33 1(OS_NUL) 5(OS_NUL) 8(TAB); OPA34 1(OS_NUL) 5(OS_NUL) 8(TAB); OPA192 1(OS_NUL) 5(OS_NUL) 8(TAB); P12 3 4; P13 3 4 6; Q21 2(I2_L) 3(Com) 4(Out) 5(In) 6(Sub) 7(I2_H)

### Notes on the sheet
- (near R110) 2019.8.10  12:58 FIX
- (near R122) 1mA挡
- (near 40) 3.6K//3.3K
- (near 41) 24K+10K
- 470+15
- Labels drawn without touching a wire or pin: 交流恒流输入
- Title
- Size:
- Date:
- A3
- Number:
- Time:
- Revision:
- Sheet
- of
- File:

### Library data of the parts
1N4148#1 1N4148#2 = Diode 1N4001: 1 Amp General Purpose Rectifier; Published: 8-Jun-2000; LatestRevisionDate: 17-Jul-2002; LatestRevisionNote: Re-released for DXP Platform.; DatasheetVersion: 1998; PackageVersion: Aug-1999; PackageReference: DO-41; Publisher: Altium Limited; PackageDescription: Diode, Axial; Body 5.2 x 2.7 mm (LxDia. max), Lead Dia. 0.86 mm (max); Code_JEDEC: DO-204-AL; ComponentLink1Description: Manufacturer Link; ComponentLink1URL: http://www.fairchildsemi.com/; ComponentLink2Description: Datasheet; ComponentLink2URL: http://www.fairchildsemi.com/ds/1N%2F1N4001.pdf
38 39 101 104#1 104#2 = Cap: Capacitor; Value: 100pF; Published: 8-Jun-2000; LatestRevisionDate: 17-Jul-2002; LatestRevisionNote: Re-released for DXP Platform.; PackageReference: RAD-0.3; Publisher: Altium Limited; PackageDescription: Radial Cap, Thru-Hole; 2 Leads; 0.3 in Pin Spacing
40-42 R135 R136 = Res1: Resistor; Published: 8-Jun-2000; LatestRevisionDate: 17-Jul-2002; LatestRevisionNote: Re-released for DXP Platform.; PackageReference: AXIAL-0.3; Publisher: Altium Limited; PackageDescription: Axial Device, Thru-Hole; 2 Leads; 0.3 in Pin Spacing
*10 Q21 = Component_1
A11-A14 = MAX2662
AR6-AR8 OPA28-OPA34 OPA192 = Op Amp: FET Operational Amplifier; Published: 8-Jun-2000; LatestRevisionDate: 17-Jul-2002; LatestRevisionNote: Re-released for DXP Platform.; DatasheetVersion: REV. B; PackageVersion: 1990; PackageReference: H-08A; Publisher: Altium Limited; PackageDescription: Can; 8 Leads; Pin Circle Dia. 5.08 mm; Lead Dia. 0.53 mm (max); ComponentLink1Description: Manufacturer Link; ComponentLink1URL: http://www.analog.com/
C122-C127 C129 C131-C135 C139-C142 C149 C150 = CAP: Capacitor
  C131 C132 C134 C139-C142 C149 C150: Value: 104
C128 C130 C136-C138 C143-C148 C151-C154 = Cap: Capacitor; Published: 8-Jun-2000; LatestRevisionDate: 17-Jul-2002; LatestRevisionNote: Re-released for DXP Platform.; PackageReference: RAD-0.3; Publisher: Altium Limited; PackageDescription: Radial Cap, Thru-Hole; 2 Leads; 0.3 in Pin Spacing
P11 = Header 8: Header, 8-Pin; LatestRevisionDate: 17-Jul-2002; LatestRevisionNote: Re-released for DXP Platform.; Publisher: Altium Limited
P12 P13 = Header 3X2: Header, 3-Pin, Dual row; LatestRevisionDate: 17-Jul-2002; LatestRevisionNote: Re-released for DXP Platform.; Publisher: Altium Limited
P14 = Header 2H: Header, 2-Pin, Right Angle; LatestRevisionDate: 17-Jul-2002; LatestRevisionNote: Re-released for DXP Platform.; Publisher: Altium Limited
Q15-Q17 = 2N3904: NPN General Purpose Amplifier; Published: 8-Jun-2000; LatestRevisionDate: 15-Jan-2003; LatestRevisionNote: PCB Footprint 'BCY-W3/D4.7' replaced; DatasheetVersion: 1997; PackageVersion: Sep-1998; PackageReference: TO-92A; Publisher: Altium Limited; PackageDescription: TO, Flat Index; 3 In-Line, Axial Leads; Body Dia. 4.5mm; Leads 0.51 x 0.48 mm (max); ComponentLink1Description: Manufacturer Link; ComponentLink1URL: http://www.fairchildsemi.com/; ComponentLink2Description: Datasheet; ComponentLink2URL: http://www.fairchildsemi.com/ds/2N%2F2N3904.pdf
Q18-Q20 = 2N3906: PNP General Purpose Amplifier; Published: 8-Jun-2000; LatestRevisionDate: 15-Jan-2003; LatestRevisionNote: PCB Footprint 'BCY-W3/D4.7' replaced; DatasheetVersion: 1997; PackageVersion: Sep-1998; PackageReference: TO-92A; Publisher: Altium Limited; PackageDescription: TO, Flat Index; 3 In-Line, Axial Leads; Body Dia. 4.5mm; Leads 0.51 x 0.48 mm (max); ComponentLink1Description: Manufacturer Link; ComponentLink1URL: http://www.fairchildsemi.com/; ComponentLink2Description: Datasheet; ComponentLink2URL: http://www.fairchildsemi.com/ds/2N%2F2N3906.pdf
R109 R111 R119-R121 R124-R134 R137 = Res2: Resistor; Published: 8-Jun-2000; LatestRevisionDate: 17-Jul-2002; LatestRevisionNote: Re-released for DXP Platform.; PackageReference: AXIAL-0.4; Publisher: Altium Limited; PackageDescription: Axial Device, Thru-Hole; 2 Leads; 0.4 in Pin Spacing
R110 R112-R118 R122 R123 = RES2

## Nets that join several sheets
+5V: 总电路图 (30 pins), 总电路图2 (20 pins)
+12: 总电路图 (6 pins), 总电路图2 (6 pins)
+12V: 总电路图 (9 pins), 总电路图2 (15 pins)
-5V: 总电路图 (27 pins), 总电路图2 (17 pins)
-12: 总电路图 (A4.4 A5.4 C104.2 C108.2), 总电路图2 (A13.4 A14.4 C142.2 C150.2)
-12V: 总电路图 (9 pins), 总电路图2 (13 pins)
GND: 电源模块 (8 pins), 总电路图 (80 pins), 总电路图2 (58 pins)
负载-: 总电路图 (5 pins), 总电路图2 (P14.2)
NetP2_1: 电源模块 (P2.1), 总电路图 (P6.1), 总电路图2 (P12.1)
NetP2_2: 电源模块 (P2.2), 总电路图 (P6.2), 总电路图2 (P12.2)
NetP2_6: 电源模块 (P2.6), 总电路图 (P6.6), 总电路图2 (P12.6)
NetP8_1: 总电路图 (P8.1), 总电路图2 (P13.1)
NetP8_2: 总电路图 (P8.2), 总电路图2 (P13.2)